# EAGLE design toshiba_board (EAGLE 7.1.0)
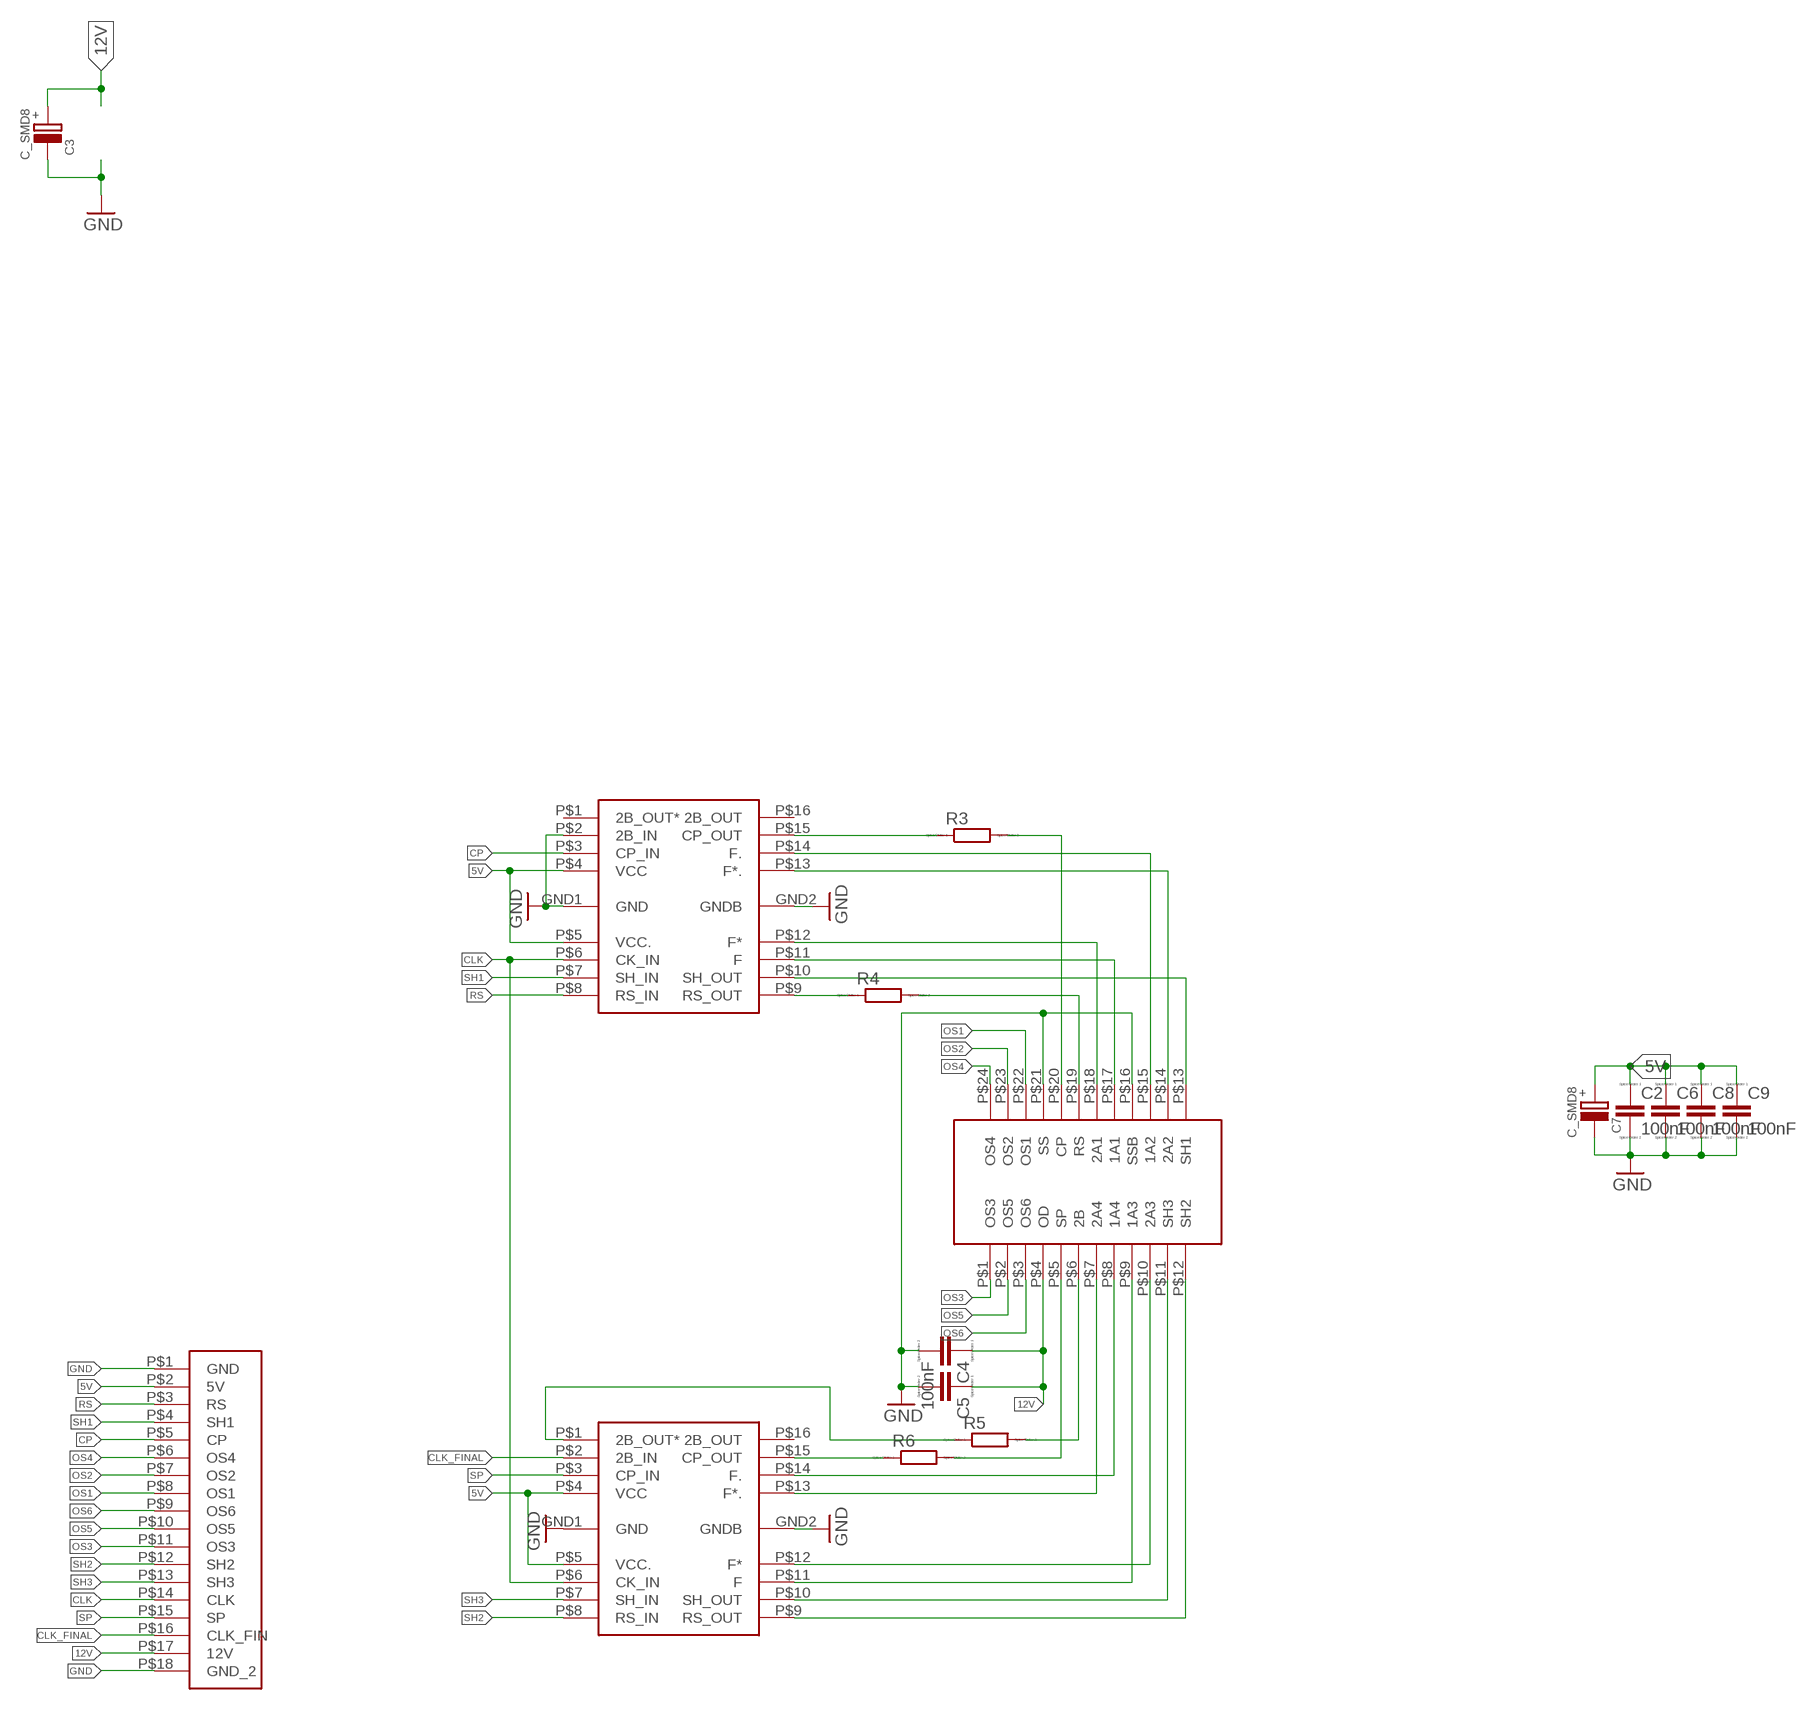
[diagram p0: schematic, sheet 1]

## Parts
C2  100nF  C-EUC0603  [C0603]
C3  C_SMD8  [C-SMD-8MM]
C4  100nF  C-EUC0603  [C0603]
C5  C-EUC0805  [C0805]
C6  100nF  C-EUC0603  [C0603]
C7  C_SMD8  [C-SMD-8MM]
C8  100nF  C-EUC0603  [C0603]
C9  100nF  C-EUC0603  [C0603]
R3  R-EU_R0603  [R0603]
R4  R-EU_R0603  [R0603]
R5  R-EU_R0603  [R0603]
R6  R-EU_R0603  [R0603]
U$1  TB62801F  [TB62801F]
U$2  TCD2700TCD  [TCD2700]
U$3  TB62801F  [TB62801F]
U$4  PIN_18  [PAD_18]

## Nets
5V: C2.1 C6.1 C7.+ C8.1 C9.1 U$1.P$4(VCC) U$1.P$5(VCC.) U$3.P$4(VCC) U$3.P$5(VCC.) U$4.P$2(5V)
12V: C3.+ C4.1 C5.1 U$2.P$4(OD) U$4.P$17(12V)
CLK: U$1.P$6(CK_IN) U$3.P$6(CK_IN) U$4.P$14(CLK)
CLK_FINAL: U$1.P$2(2B_IN) U$4.P$16(CLK_FIN)
CP: U$3.P$3(CP_IN) U$4.P$5(CP)
GND: C2.2 C3.- C4.2 C5.2 C6.2 C7.- C8.2 C9.2 U$1.GND1(GND) U$1.GND2(GNDB) U$2.P$16(SSB) U$2.P$21(SS) U$3.GND1(GND) U$3.GND2(GNDB) U$3.P$2(2B_IN) U$4.P$1(GND) U$4.P$18(GND_2)
N$1: U$1.P$9(RS_OUT) U$2.P$12(SH2)
N$2: U$1.P$10(SH_OUT) U$2.P$11(SH3)
N$3: U$1.P$11(F) U$2.P$9(1A3)
N$4: U$1.P$12(F*) U$2.P$10(2A3)
N$5: U$1.P$13(F*.) U$2.P$7(2A4)
N$6: U$1.P$14(F.) U$2.P$8(1A4)
N$7: R6.1 U$1.P$15(CP_OUT)
N$9: R6.2 U$2.P$5(SP)
N$10: R5.1 U$1.P$1(2B_OUT*)
N$11: R5.2 U$2.P$6(2B)
N$16: R3.2 U$2.P$20(CP)
N$17: U$2.P$15(1A2) U$3.P$14(F.)
N$18: U$2.P$14(2A2) U$3.P$13(F*.)
N$19: U$2.P$18(2A1) U$3.P$12(F*)
N$20: U$2.P$17(1A1) U$3.P$11(F)
N$21: U$2.P$13(SH1) U$3.P$10(SH_OUT)
N$22: R3.1 U$3.P$15(CP_OUT)
N$23: R4.2 U$2.P$19(RS)
N$24: R4.1 U$3.P$9(RS_OUT)
OS1: U$2.P$22(OS1) U$4.P$8(OS1)
OS2: U$2.P$23(OS2) U$4.P$7(OS2)
OS3: U$2.P$1(OS3) U$4.P$11(OS3)
OS4: U$2.P$24(OS4) U$4.P$6(OS4)
OS5: U$2.P$2(OS5) U$4.P$10(OS5)
OS6: U$2.P$3(OS6) U$4.P$9(OS6)
RS: U$3.P$8(RS_IN) U$4.P$3(RS)
SH1: U$3.P$7(SH_IN) U$4.P$4(SH1)
SH2: U$1.P$8(RS_IN) U$4.P$12(SH2)
SH3: U$1.P$7(SH_IN) U$4.P$13(SH3)
SP: U$1.P$3(CP_IN) U$4.P$15(SP)
Unconnected: U$1.P$16(2B_OUT) U$3.P$1(2B_OUT*) U$3.P$16(2B_OUT)

## Library data of the parts
C2 C4-C6 C8 C9 = resistor:C-EU: CAPACITOR, European symbol; SPICEPREFIX: C
C3 C7 = diverses:C_SMD
R3-R6 = resistor:R-EU_: RESISTOR, European symbol; SPICEPREFIX: R
U$1 U$3 = Diverse:TB62801F
U$2 = Diverse:TCD2700
U$4 = Diverse:PIN_18

## Net classes
1 pwr: width 0.305 mm
2 raw: width 0.305 mm

## Board
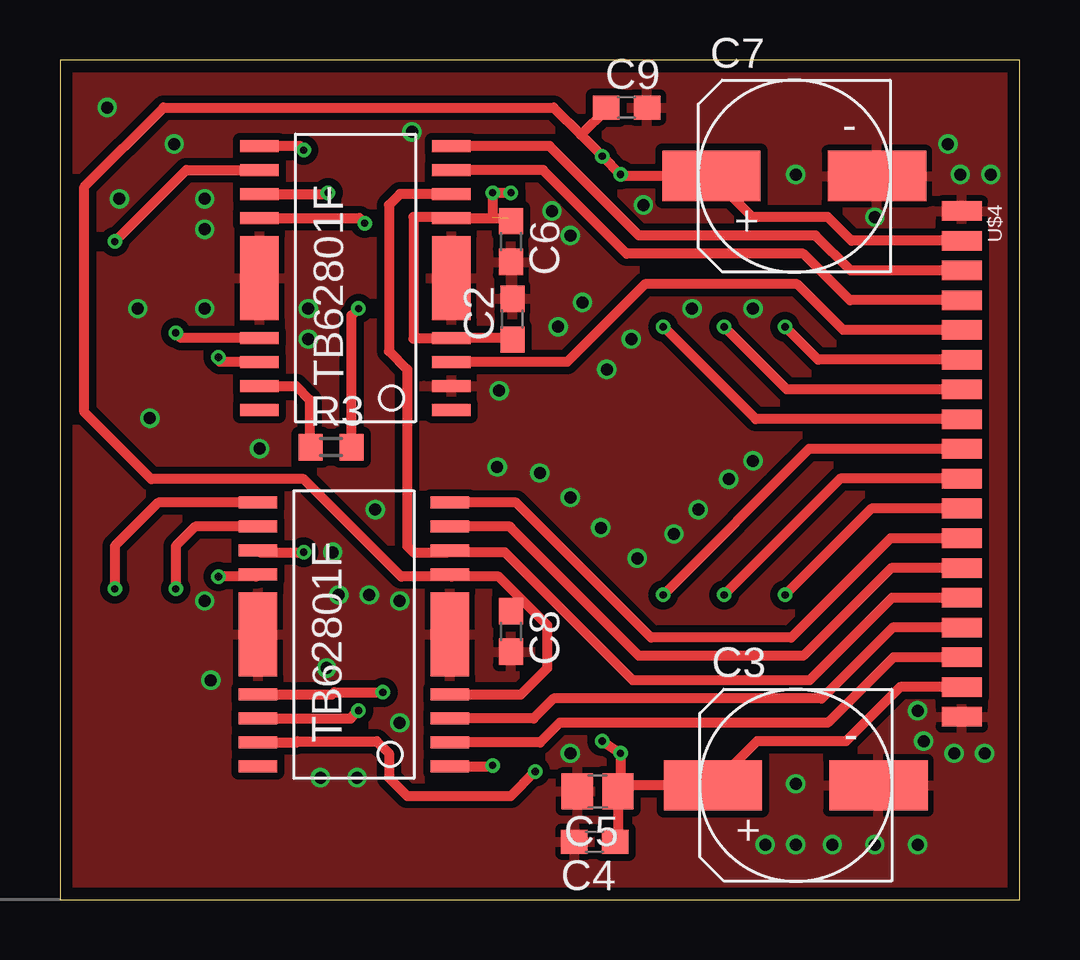
[diagram p1: board, top side]
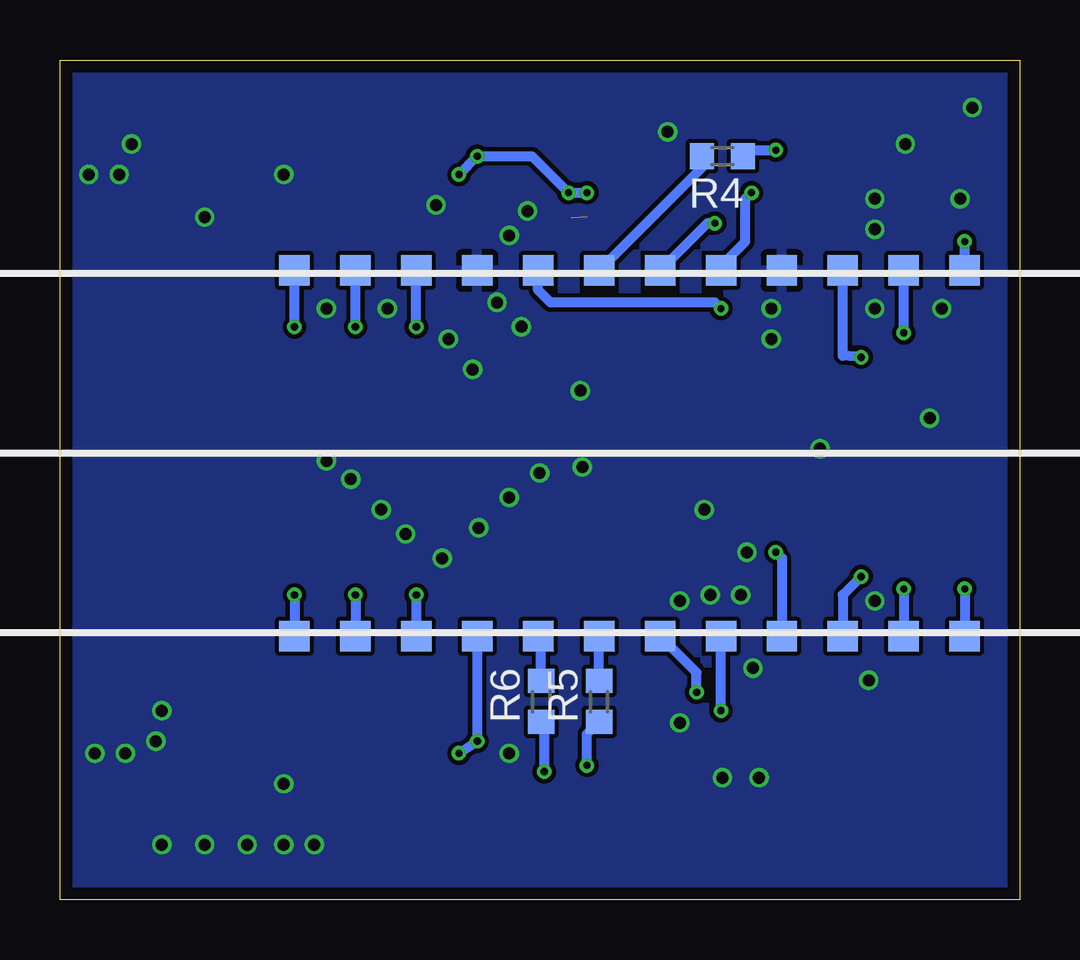
[diagram p2: board, bottom side, seen from below]

Size 40 x 35 mm. Coordinates in mm from the lower left corner, seen from the top.
Outline: 0,0 40,0 40,35 0,35 0,0
Copper layers (1*16): Top 0.035mm / dielectric 1.5mm / Bottom 0.035mm
Design rules "ShenZhen2U EagleRules": minimum track width 7mil, minimum drill 12mil, track to track 7mil, track to pad 7mil, pad to pad 7mil, via to via 7mil, smd to smd 0mil, copper to edge 20mil, drill to drill 10mil, minimum pad ring 10mil, minimum via ring 6mil, stop-mask expansion 2mil, vias tented up to drill 25mil, thermal gap 10mil

### Footprints (pad centres in the part's own frame; a part is rotated, then mirrored left to right if it is on the bottom)
C0603 = smd 1.1 x 1: 1 -0.85,0; 2 0.85,0
C-SMD-8MM = smd 4.1 x 2.1: + -3.45,0; - 3.45,0
C0805 = smd 1.3 x 1.5: 1 -0.85,0; 2 0.85,0
R0603 = smd 1 x 1.1: 1 -0.85,0; 2 0.85,0
TB62801F = smd 3.5 x 1.6: GND1 0,-4; GND2 0,4 | smd 0.5 x 1.6: P$1 -5.5,-4; P$2 -4.5,-4; P$3 -3.5,-4; P$4 -2.5,-4; P$5 2.5,-4; P$6 3.5,-4; P$7 4.5,-4; P$8 5.5,-4; P$9 5.5,4; P$10 4.5,4; P$11 3.5,4; P$12 2.5,4; P$13 -2.5,4; P$14 -3.5,4; P$15 -4.5,4; P$16 -5.5,4
TCD2700 = smd 1.27 x 1.27: P$1 -7.62,12.7; P$2 -7.62,10.16; P$3 -7.62,7.62; P$4 -7.62,5.08; P$5 -7.62,2.54; P$6 -7.62,0; P$7 -7.62,-2.54; P$8 -7.62,-5.08; P$9 -7.62,-7.62; P$10 -7.62,-10.16; P$11 -7.62,-12.7; P$12 -7.62,-15.24; P$13 7.62,-15.24; P$14 7.62,-12.7; P$15 7.62,-10.16; P$16 7.62,-7.62; P$17 7.62,-5.08; P$18 7.62,-2.54; P$19 7.62,0; P$20 7.62,2.54; P$21 7.62,5.08; P$22 7.62,7.62; P$23 7.62,10.16; P$24 7.62,12.7
PAD_18 = smd 0.813 x 1.676: P$1 0,0; P$2 1.24,0; P$3 2.48,0; P$4 3.72,0; P$5 4.96,0; P$6 6.2,0; P$7 7.44,0; P$8 8.68,0; P$9 9.92,0; P$10 11.16,0; P$11 12.4,0; P$12 13.64,0; P$13 14.88,0; P$14 16.12,0; P$15 17.36,0; P$16 18.6,0; P$17 19.84,0; P$18 21.08,0

### Placement (x,y rotation side)
C2  18.86,24.19 90 top
C3  30.67,4.76 0 top
C4  22.29,2.41 180 top
C5  22.42,4.51 180 top
C6  18.8,27.43 270 top
C7  30.61,30.16 0 top
C8  18.8,11.18 270 top
C9  23.62,33.02 0 top
R3  11.3,18.86 0 top
R4  12.38,30.99 180 bottom
R5  17.53,8.26 90 bottom
R6  19.94,8.26 90 bottom
U$1  12.26,11.05 90 top
U$2  17.53,18.61 90 bottom
U$3  12.32,25.91 90 top
U$4  37.59,28.7 270 top

### Tracks (layer width: path | path; a pad name or v marks a point on that pad's centre or on a via)
5V  (via drill 0.3)  (1 unrouted)
  Top 0.406: C2.1 18.67,23.41 U$3.P$4 14.77,23.41 14.73,23.37 14.73,28.45 16.28,28.45 U$3.P$5 18.67,28.41 C6.1 | v18.8,29.46 v18.03,29.46 18.03,28.45 | 16.34,13.46 18.29,13.46 19.3,12.45 | 16.34,13.46 U$1.P$5 | 16.34,13.46 14.22,13.46 10.16,17.53 3.81,17.53 1.02,20.32 1.02,29.72 4.32,33.02 20.57,33.02 21.72,31.88 | 21.72,31.88 v22.61,30.99 v23.37,30.23 23.43,30.16 C7.+ 28.87,28.45 32,28.45 32.99,27.46 U$4.P$2 | C9.1 22.77,32.93 21.72,31.88 | U$1.P$4 19.22,8.55 20.32,9.65 20.32,11.43 19.3,12.45 | C8.1 18.88,12.03 19.3,12.45
  Bottom 0.406: v18.03,29.46 v18.8,29.46 20.32,30.99 v22.61,30.99 v23.37,30.23
12V  (via drill 0.3)
  Top 0.406: v22.61,6.6 v23.37,6.1 23.37,4.61 | 37.56,8.89 U$4.P$17 35.02,8.86 32.77,6.6 29.06,6.6 C3.+ 23.52,4.76 23.37,4.61 | 23.37,4.61 C5.1 23.27,2.54 C4.1
  Bottom 0.406: v23.37,6.1 v22.61,6.6 U$2.P$4
CLK
  Top 0.406: U$3.P$6 14.17,29.41 13.72,28.96 13.72,22.86 14.48,22.1 14.48,14.73 14.73,14.48 16.18,14.48 | 16.18,14.48 U$1.P$6 | U$4.P$14 34.68,12.58 31.24,9.14 23.88,9.14 18.54,14.48 16.18,14.48
CLK_FINAL
  Top 0.406: U$4.P$16 34.74,10.1 32,7.37 20.83,7.37 20.01,6.55 U$1.P$2
CP
  Top 0.406: U$4.P$5 32.65,23.74 30.73,25.65 24.38,25.65 21.14,22.41 U$3.P$3
GND  (via drill 0.5)
  other vias: 20.76,23.88 21.78,24.89 21.27,27.69 20.51,28.7 12.89,12.7 11.62,12.7 37.02,31.5 37.53,30.23 38.54,6.1 36,6.6 37.27,6.1 6.03,24.64 6.03,27.94 6.03,29.21 18.31,21.21 18.22,18.03 10.35,24.64 10.35,23.37 3.24,24.64 8.32,18.8 3.75,20.07 6.29,9.14 6.03,12.45 11.11,9.65 14.16,7.37 14.16,12.45 11.37,14.48 13.14,16.26 33.97,2.29 35.75,2.29 29.4,2.29 32.19,2.29 30.67,2.29 38.8,30.23 2.48,29.21 30.67,30.23 33.97,28.45 4.76,31.5 1.97,33.02 28.89,24.64 26.35,24.64 23.81,23.37 22.8,22.1 28.89,18.29 27.88,17.53 26.61,16.26 25.59,15.24 24.07,14.22 22.54,15.49 21.27,16.76 20,17.78 35.75,7.87 21.27,6.1 12.38,5.08 10.86,5.08 30.67,4.83 14.67,32 24.32,28.96
  pour Bottom: 0,0 40,0 40,35 0,35
  pour Top (isolate 0.305): 0,0 40,0 40,35 0,35
N$1  (via drill 0.3)
  Top 0.406: U$1.P$9 4.1,16.55 2.29,14.73 v2.29,12.95
  Bottom 0.406: v2.29,12.95 U$2.P$12
N$2  (via drill 0.3)
  Top 0.406: U$1.P$10 5.64,15.55 4.83,14.73 v4.83,12.95
  Bottom 0.406: v4.83,12.95 U$2.P$11
N$3  (via drill 0.3)
  Top 0.406: U$1.P$11 8.33,14.48 v10.16,14.48
  Bottom 0.406: v10.16,14.48 9.91,14.22 U$2.P$9
N$4  (via drill 0.3)
  Top 0.406: U$1.P$12 8.17,13.46 v6.6,13.46
  Bottom 0.406: v6.6,13.46 7.37,12.7 U$2.P$10
N$5  (via drill 0.3)
  Top 0.406: U$1.P$13 11.34,8.55 11.43,8.64 v13.46,8.64
  Bottom 0.406: v13.46,8.64 13.46,9.46 U$2.P$7
N$6  (via drill 0.3)
  Top 0.406: U$1.P$14 12.12,7.55 v12.45,7.87
  Bottom 0.406: v12.45,7.87 U$2.P$8
N$7  (via drill 0.3)
  Top 0.406: U$1.P$15 9.85,6.55 9.91,6.6 13.21,6.6 13.72,6.1 13.72,5.08 14.48,4.32 18.8,4.32 v19.81,5.33
  Bottom 0.406: v19.81,5.33 19.81,7.28 R6.1
N$9
  Bottom 0.406: R6.2 19.94,10.86 U$2.P$5
N$10  (via drill 0.3)
  Top 0.406: U$1.P$1 18,5.55 v18.03,5.59
  Bottom 0.406: v18.03,5.59 18.03,6.9 R5.1
N$11
  Bottom 0.406: R5.2 U$2.P$6
N$16  (via drill 0.3)
  Top 0.406: R3.2 12.15,24.34 v12.45,24.64
  Bottom 0.406: v12.45,24.64 12.7,24.89 19.56,24.89 20.07,25.4 U$2.P$20
N$17  (via drill 0.3)
  Top 0.406: U$3.P$14 6.66,22.41 v6.6,22.61
  Bottom 0.406: v6.6,22.61 7.37,22.67 U$2.P$15
N$18  (via drill 0.3)
  Top 0.406: U$3.P$13 5.04,23.41 v4.83,23.62
  Bottom 0.406: v4.83,23.62 U$2.P$14
N$19  (via drill 0.3)
  Top 0.406: U$3.P$12 12.49,28.41 v12.7,28.19
  Bottom 0.406: v12.7,28.19 13.02,28.19 U$2.P$18
N$20  (via drill 0.3)
  Top 0.406: U$3.P$11 10.98,29.41 v11.18,29.46
  Bottom 0.406: U$2.P$17 12.45,26.42 11.43,27.43 11.43,29.21 v11.18,29.46
N$21  (via drill 0.3)
  Top 0.406: v2.29,27.43 5.26,30.41 U$3.P$10
  Bottom 0.406: U$2.P$13 v2.29,27.43
N$22
  Top 0.406: U$3.P$15 9.83,21.41 10.41,20.83 10.41,18.9 R3.1
N$23
  Bottom 0.406: U$2.P$19 13.23,30.52 R4.2
N$24  (via drill 0.3)
  Top 0.406: v10.16,31.24 9.99,31.41 U$3.P$9
  Bottom 0.406: R4.1 11.28,31.24 v10.16,31.24
OS1  (via drill 0.3)
  Top 0.406: U$4.P$8 29,20.02 v25.15,23.88
  Bottom 0.406: v25.15,23.88 U$2.P$22
OS2  (via drill 0.3)
  Top 0.406: U$4.P$7 30.3,21.26 v27.69,23.88
  Bottom 0.406: v27.69,23.88 U$2.P$23
OS3  (via drill 0.3)
  Top 0.406: U$4.P$11 33.83,16.3 v30.23,12.7
  Bottom 0.406: v30.23,12.7 U$2.P$1
OS4  (via drill 0.3)
  Top 0.406: U$4.P$6 31.6,22.5 v30.23,23.88
  Bottom 0.406: v30.23,23.88 U$2.P$24
OS5  (via drill 0.3)
  Top 0.406: U$4.P$10 32.53,17.54 v27.69,12.7
  Bottom 0.406: v27.69,12.7 U$2.P$2
OS6  (via drill 0.3)
  Top 0.406: U$4.P$9 31.23,18.78 v25.15,12.7
  Bottom 0.406: v25.15,12.7 U$2.P$3
RS
  Top 0.406: U$4.P$3 32.96,26.22 31.5,27.69 24.13,27.69 20.41,31.41 U$3.P$8
SH1
  Top 0.406: U$4.P$4 32.93,24.98 30.99,26.92 23.62,26.92 20.14,30.41 U$3.P$7
SH2
  Top 0.406: U$4.P$12 34.62,15.06 30.48,10.92 24.64,10.92 19.01,16.55 U$1.P$8
SH3
  Top 0.406: U$4.P$13 34.65,13.82 30.99,10.16 24.13,10.16 18.8,15.49 arc90 18.74,15.55 U$1.P$7
SP
  Top 0.406: U$4.P$15 34.71,11.34 31.75,8.38 20.57,8.38 19.74,7.55 U$1.P$3

### Text on the board
Notes: 1